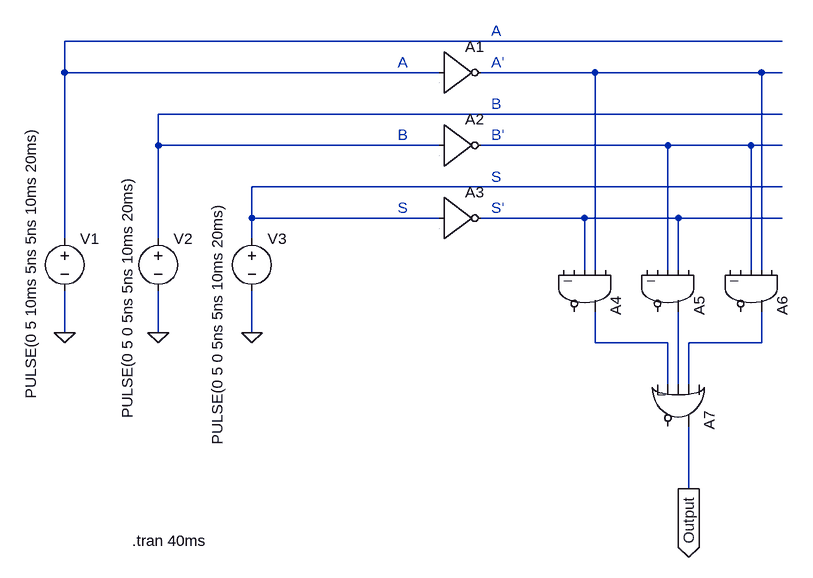
[diagram p0: schematic Circuit2_1.asc]
Circuit2_1.asc, the LTspice schematic file:
Version 4
SHEET 1 880 764
WIRE 544 -64 -560 -64
WIRE -560 -16 -560 -64
WIRE 16 -16 -560 -16
WIRE 256 -16 80 -16
WIRE 512 -16 256 -16
WIRE 544 -16 512 -16
WIRE 544 48 -416 48
WIRE -416 96 -416 48
WIRE 16 96 -416 96
WIRE 368 96 80 96
WIRE 496 96 368 96
WIRE 544 96 496 96
WIRE 544 160 -272 160
WIRE -272 208 -272 160
WIRE 16 208 -272 208
WIRE 240 208 80 208
WIRE 384 208 240 208
WIRE 544 208 384 208
WIRE -560 240 -560 -16
WIRE -416 240 -416 96
WIRE -272 240 -272 208
WIRE 240 288 240 208
WIRE 256 288 256 -16
WIRE 368 288 368 96
WIRE 384 288 384 208
WIRE 496 288 496 96
WIRE 512 288 512 -16
WIRE -560 384 -560 320
WIRE -416 384 -416 320
WIRE -272 384 -272 320
WIRE 256 400 256 352
WIRE 368 400 256 400
WIRE 512 400 512 352
WIRE 512 400 400 400
WIRE 368 464 368 400
WIRE 384 464 384 352
WIRE 400 464 400 400
WIRE 400 624 400 528
FLAG -560 384 0
FLAG -416 384 0
FLAG -272 384 0
FLAG 400 624 Output
IOPIN 400 624 Out
SYMBOL Digital\\inv 16 -80 R0
SYMATTR InstName A1
SYMBOL Digital\\inv 16 32 R0
SYMATTR InstName A2
SYMBOL Digital\\inv 16 144 R0
SYMATTR InstName A3
SYMBOL Digital\\and 304 320 R90
SYMATTR InstName A4
SYMBOL Digital\\and 432 320 R90
SYMATTR InstName A5
SYMBOL Digital\\and 560 320 R90
SYMATTR InstName A6
SYMBOL Digital\\or 448 496 R90
SYMATTR InstName A7
SYMBOL voltage -560 224 R0
WINDOW 3 -52 -156 VRight 2
WINDOW 123 0 0 Left 0
WINDOW 39 0 0 Left 0
SYMATTR Value PULSE(0 5 10ms 5ns 5ns 10ms 20ms)
SYMATTR InstName V1
SYMBOL voltage -416 224 R0
WINDOW 3 -48 -80 VRight 2
WINDOW 123 0 0 Left 0
WINDOW 39 0 0 Left 0
SYMATTR Value PULSE(0 5 0 5ns 5ns 10ms 20ms)
SYMATTR InstName V2
SYMBOL voltage -272 224 R0
WINDOW 3 -53 -39 VRight 2
WINDOW 123 0 0 Left 0
WINDOW 39 0 0 Left 0
SYMATTR Value PULSE(0 5 0 5ns 5ns 10ms 20ms)
SYMATTR InstName V3
TEXT -48 -32 Left 2 ;A
TEXT -48 80 Left 2 ;B
TEXT -456 704 Left 2 !.tran 40ms
TEXT -48 192 Left 2 ;S
TEXT 96 -32 Left 2 ;A'
TEXT 96 80 Left 2 ;B'
TEXT 96 192 Left 2 ;S'
TEXT 96 -80 Left 2 ;A
TEXT 96 32 Left 2 ;B
TEXT 96 144 Left 2 ;S

The netlist it stands for:
* Circuit2_1.asc
A1 N001 0 0 0 0 N002 0 0 BUF
A2 N003 0 0 0 0 N004 0 0 BUF
A3 N005 0 0 0 0 N006 0 0 BUF
A4 0 N002 N006 0 0 0 N007 0 AND
A5 0 N006 N004 0 0 0 N009 0 AND
A6 0 N002 N004 0 0 0 N008 0 AND
A7 0 N008 N009 N007 0 0 Output 0 OR
V1 N001 0 PULSE(0 5 10ms 5ns 5ns 10ms 20ms)
V2 N003 0 PULSE(0 5 0 5ns 5ns 10ms 20ms)
V3 N005 0 PULSE(0 5 0 5ns 5ns 10ms 20ms)
* A
* B
.tran 40ms
* S
* A'
* B'
* S'
* A
* B
* S
.backanno
.end